# Altium schematic sheet Board_MCU_v3.SchDoc
size A4
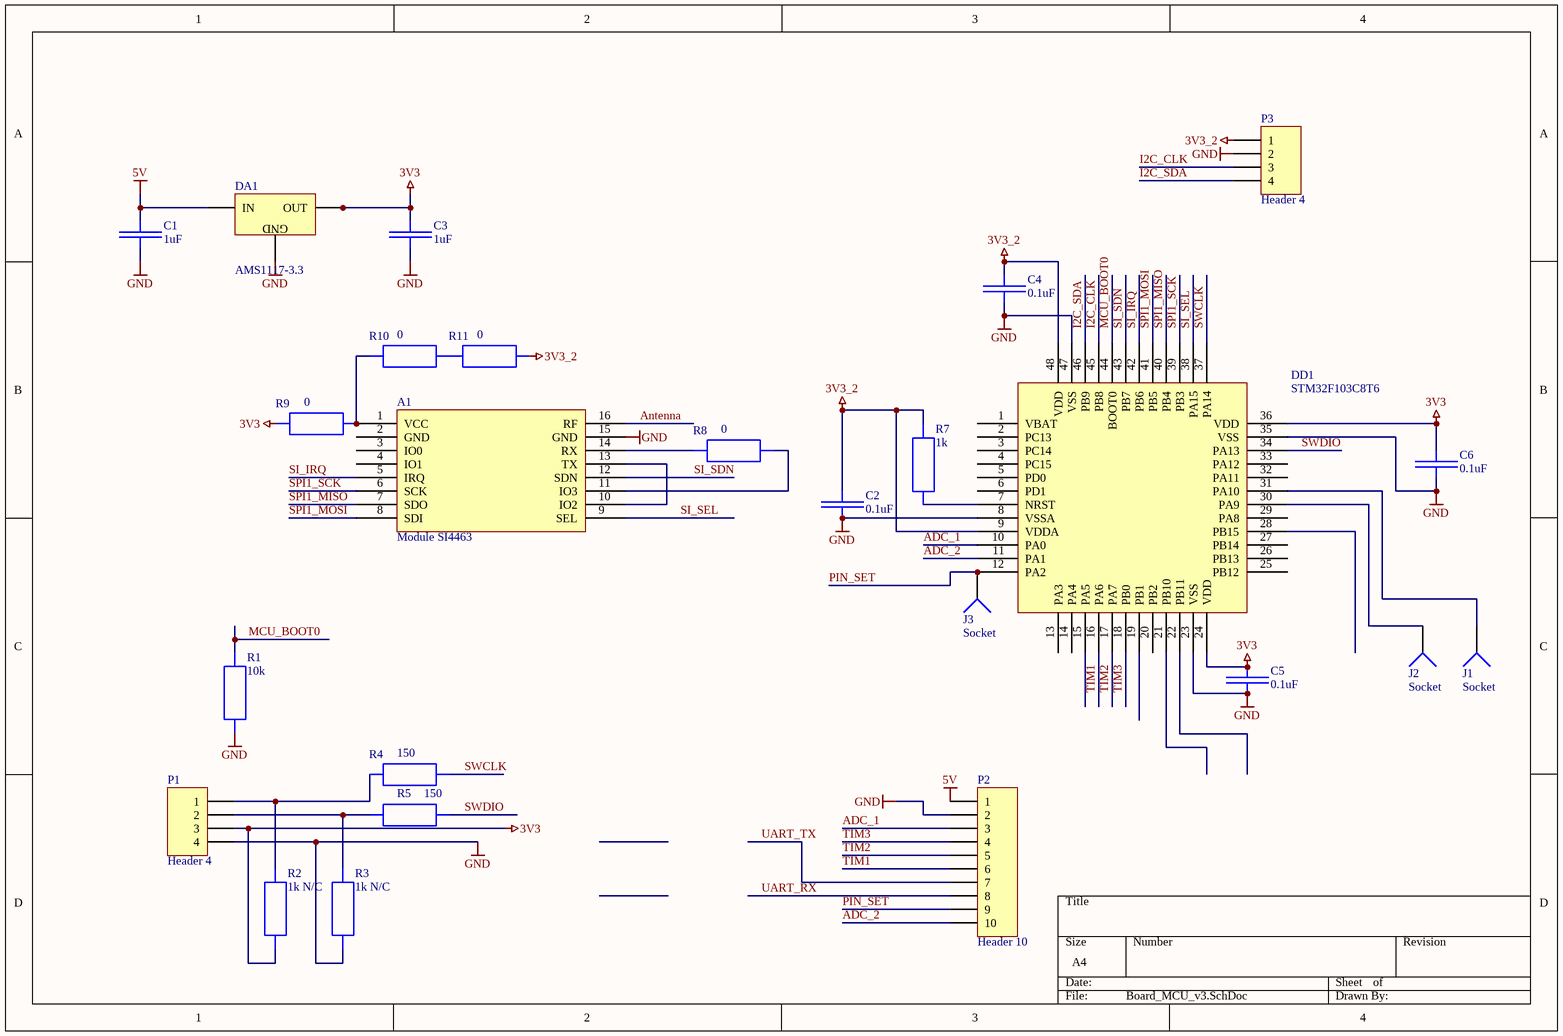
[diagram p0: Board_MCU_v3.SchDoc]

## Parts
A1  Module SI4463  [MODULE_SI44663]
C1  1uF  [0805cap]
C2  0.1uF  [0805cap]
C3  1uF  [0805cap]
C4  0.1uF  [0805cap]
C5  0.1uF  [0805cap]
C6  0.1uF  [0805cap]
DA1  AMS1117-3.3  [SOT-223]
DD1  STM32F103C8T6  [STM32L151C]
J1  Socket  [PIN1]
J2  Socket  [PIN1]
J3  Socket  [PIN1]
P1  Header 4  [HDR1X4]
P2  Header 10  [HDR1X10]
P3  Header 4  [HDR1X4]
R1  10k  [0805res]
R2  1k N/C  [0805res]
R3  1k N/C  [0805res]
R4  150  [0805res]
R5  150  [0805res]
R7  1k  [0805res]
R8  0  [0805res]
R9  0  [0805res]
R10  0  [0805res]
R11  0  [0805res]

## Nets
3V3: C3.1 C5.1 C6.1 DA1.2(OUT) DA1.4 DD1.24(VDD) DD1.36(VDD) P1.3 R2.2 R9.1
3V3_2: C2.1 C4.1 DD1.9(VDDA) DD1.48(VDD) P3.1 R7.1 R11.2
5V: C1.1 DA1.3(IN) P2.1
GND: A1.15(GND) C1.2 C2.2 C3.2 C4.2 C5.2 C6.2 DA1.1(GND) DD1.8(VSSA) DD1.23(VSS) DD1.35(VSS) DD1.47(VSS) P1.4 P2.2 P3.2 R1.2 R3.2
ADC_1: DD1.10(PA0) P2.3
ADC_2: DD1.11(PA1) P2.10
Antenna: A1.16(RF)
I2C_CLK: DD1.45(PB8) P3.3
I2C_SDA: DD1.46(PB9) P3.4
MCU_BOOT0: DD1.44(BOOT0) R1.1
PIN_SET: DD1.12(PA2) J3.1 P2.9
SI_IRQ: A1.5(IRQ) DD1.42(PB6)
SI_SDN: A1.12(SDN) DD1.43(PB7)
SI_SEL: A1.9(SEL) DD1.38(PA15)
SPI1_MISO: A1.7(SDO) DD1.40(PB4)
SPI1_MOSI: A1.8(SDI) DD1.41(PB5)
SPI1_SCK: A1.6(SCK) DD1.39(PB3)
SWCLK: DD1.37(PA14) R4.1
SWDIO: DD1.34(PA13) R5.1
TIM1: DD1.16(PA6) P2.6
TIM2: DD1.17(PA7) P2.5
TIM3: DD1.18(PB0) P2.4
UART_RX: P2.8
UART_TX: P2.7
NetA1_1: A1.1(VCC) R9.2 R10.1
NetA1_10: A1.10(IO2) A1.13(TX)
NetA1_11: A1.11(IO3) R8.2
NetA1_14: A1.14(RX) R8.1
NetDD1_7: DD1.7(NRST) R7.2
NetDD1_30: DD1.30(PA9) J2.1
NetDD1_31: DD1.31(PA10) J1.1
NetP1_1: P1.1 R2.1 R4.2
NetP1_2: P1.2 R3.1 R5.2
NetR10_2: R10.2 R11.1

Not connected (* = marked no-connect by the designer): A1 2(GND) 3(IO0) 4(IO1); DD1 1(VBAT) 2(PC13) 3(PC14) 4(PC15) 5(PD0) 6(PD1) 13(PA3) 14(PA4) 15(PA5) 19(PB1) 20(PB2) 21(PB10) 22(PB11) 25(PB12) 26(PB13) 27(PB14) 28(PB15) 29(PA8) 32(PA11) 33(PA12)

## Library data of the parts
A1 = module_SI4463: VCC: 3V3
C1-C6 = Cap 0805: TitAD: Конденсатор; Voltage: *; Part Number: Cap 0805; Manufacturer Part Number: *; Voltage - Rated: *; Package / Case: SMD 0805
  C1 C3: Value: 1uF
  C2 C4-C6: Value: 0.1uF
DA1 = DA-AMS1117: LDO 3.3V 0.5A; Vin: ...15V; Iout: 1.5A; Vout: 3.3
DD1 = STM32F103C8T6: LQFP48
P1 P3 = Header 4: Header, 4-Pin; LatestRevisionDate: 17-Jul-2002; LatestRevisionNote: Re-released for DXP Platform.; Publisher: Altium Limited
P2 = Header 10: Header, 10-Pin; LatestRevisionDate: 17-Jul-2002; LatestRevisionNote: Re-released for DXP Platform.; Publisher: Altium Limited
R1-R5 R7-R11 = Res 0805: TitAD: Резистор; Tolerance: 1%; Part Number: Res 0805; Manufacturer Part Number: *; Package / Case: SMD 0805; Power (Watts): *
  R1: Value: 10k
  R2 R3: DNI: N/C; Value: 1k
  R4 R5: Value: 150
  R7: Value: 1k
  R8-R11: Value: 0
J1-J3 = Socket: LatestRevisionDate: 17-Jul-2002; LatestRevisionNote: Re-released for DXP Platform.; Publisher: Altium Limited